# Altium schematic sheet coil.SchDoc
size A
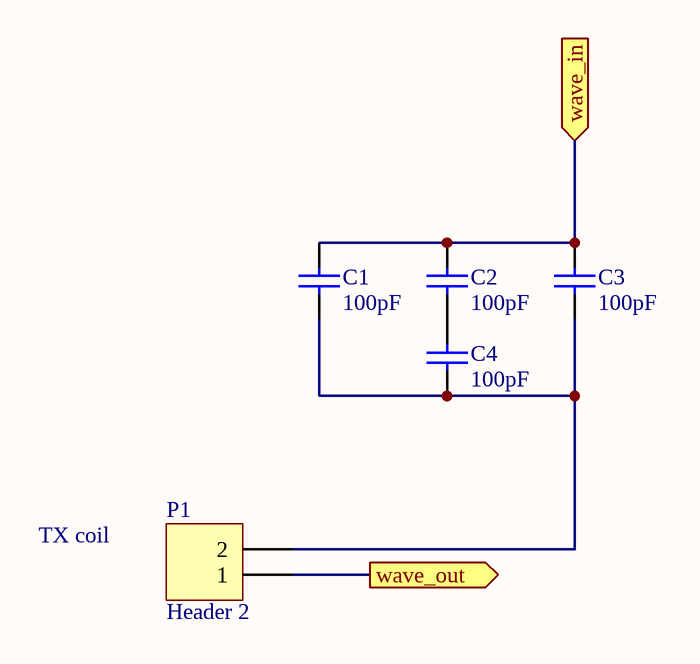
[diagram p0: coil.SchDoc]

## Parts
C1  value 100pF  [0603]  (hidden comment: Cap)
C2  value 100pF  [0603]  (hidden comment: Cap)
C3  value 100pF  [0603]  (hidden comment: Cap)
C4  value 100pF  [0603]  (hidden comment: Cap)
P1  Header 2  [HDR1X2]

## Ports
wave_in (in), wave_out (out)

## Nets
wave_in: C1.2 C2.2 C3.2 ; port wave_in
wave_out: P1.1 ; port wave_out
NetC1_1: C1.1 C3.1 C4.1 P1.2
NetC2_1: C2.1 C4.2

## Notes on the sheet
- TX coil

## Library data of the parts
C1-C4 = Cap: Ceramic Capacitor (Surface Mount); Manufacturer: Generic Ceramic Chip Cap (TBD); Digi-Key Part Number: *; Manufacturer Part Number: *; Note: *; Rating: *
P1 = Header 2: Header, 2-Pin; LatestRevisionDate: 17-Jul-2002; LatestRevisionNote: Re-released for DXP Platform.; Publisher: Altium Limited